# Altium schematic sheet P10_ATMEGA328P.SchDoc
size A4; SheetNumber: 1; SheetTotal: 2
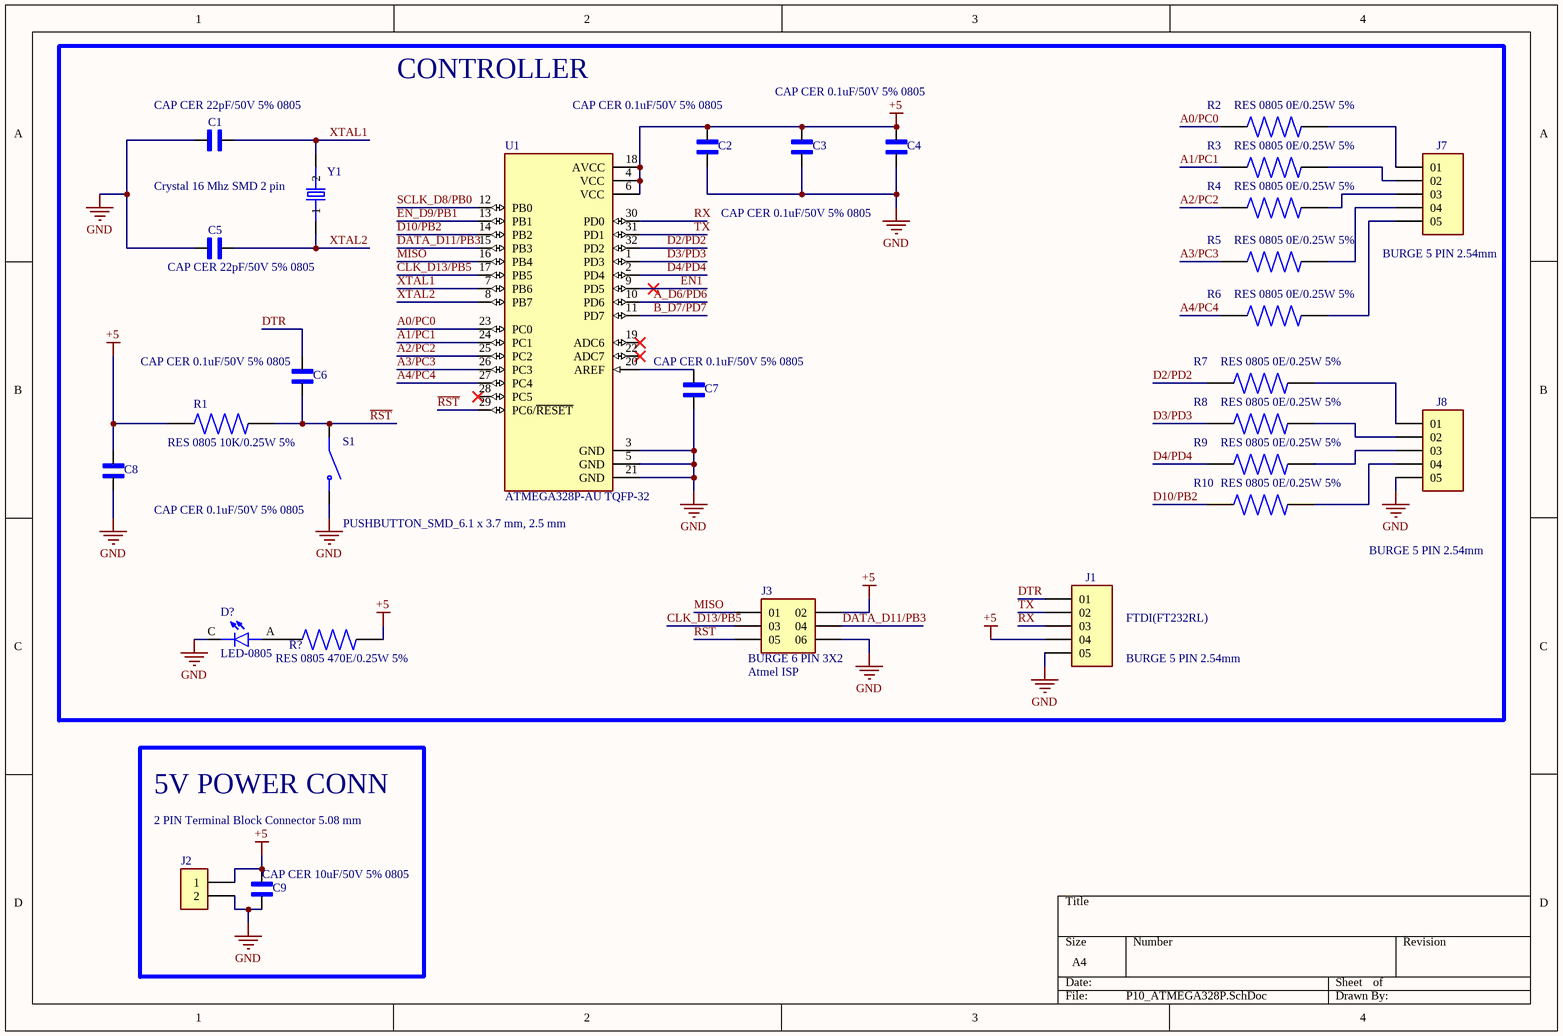
[diagram p0: P10_ATMEGA328P.SchDoc]

## Parts
C1  CAP CER 22pF/50V 5% 0805  [CAP CER 0.1uF/50V 5%]
C2  CAP CER 0.1uF/50V 5% 0805  [CAP CER 0.1uF/50V 5%]
C3  CAP CER 0.1uF/50V 5% 0805  [CAP CER 0.1uF/50V 5%]
C4  CAP CER 0.1uF/50V 5% 0805  [CAP CER 0.1uF/50V 5%]
C5  CAP CER 22pF/50V 5% 0805  [CAP CER 0.1uF/50V 5%]
C6  CAP CER 0.1uF/50V 5% 0805  [CAP CER 0.1uF/50V 5%]
C7  CAP CER 0.1uF/50V 5% 0805  [CAP CER 0.1uF/50V 5%]
C8  CAP CER 0.1uF/50V 5% 0805  [CAP CER 0.1uF/50V 5%]
C9  CAP CER 10uF/50V 5% 0805  [CAP CER 0.1uF/50V 5%]
D?  LED-0805  [LED-0805]
J1  BURGE 5 PIN 2.54mm  [BURGE 5 PIN]
J2  2 PIN Terminal Block Connector 5.08 mm  [2 PIN Terminal Block Connector 5.08 mm]
J3  BURGE 6 PIN 3X2  [BURGE 6 PIN 3X2]
J7  BURGE 5 PIN 2.54mm  [BURGE 5 PIN]
J8  BURGE 5 PIN 2.54mm  [BURGE 5 PIN]
R1  RES 0805 10K/0.25W 5%  [RES 0805 10K/0.25W 5%]
R2  RES 0805 0E/0.25W 5%  [RES 0805 10K/0.25W 5%]
R3  RES 0805 0E/0.25W 5%  [RES 0805 10K/0.25W 5%]
R4  RES 0805 0E/0.25W 5%  [RES 0805 10K/0.25W 5%]
R5  RES 0805 0E/0.25W 5%  [RES 0805 10K/0.25W 5%]
R6  RES 0805 0E/0.25W 5%  [RES 0805 10K/0.25W 5%]
R7  RES 0805 0E/0.25W 5%  [RES 0805 10K/0.25W 5%]
R8  RES 0805 0E/0.25W 5%  [RES 0805 10K/0.25W 5%]
R9  RES 0805 0E/0.25W 5%  [RES 0805 10K/0.25W 5%]
R10  RES 0805 0E/0.25W 5%  [RES 0805 10K/0.25W 5%]
R?  RES 0805 470E/0.25W 5%  [RES 0805 10K/0.25W 5%]
S1  PUSHBUTTON_SMD_6.1 x 3.7 mm, 2.5 mm  [PUSHBUTTON_SMD_6.1 x 3.7 mm, 2.5 mm]
U1  ATMEGA328P-AU TQFP-32  [ATMEGA328P-AU IC]
Y1  Crystal 16 Mhz SMD 2 pin  [Crystal 16 Mhz SMD 2 pin]

## Blocks framed on the sheet
CONTROLLER: C1-C8 D? J1 J3 J7 J8 R1-R10 R? S1 U1 Y1
5V POWER CONN: C9 J2

## Nets
+5: C2.2 C3.2 C4.2 C8.2 C9.2 J1.04 J2.1 J3.02 R1.1 R?.2 U1.4(VCC) U1.6(VCC) U1.18(AVCC)
GND: C1.1 C2.1 C3.1 C4.1 C5.1 C7.1 C8.1 C9.1 D?.C J1.05 J2.2 J3.06 J8.05 S1.2 U1.3(GND) U1.5(GND) U1.21(GND)
A0/PC0: R2.1 U1.23(PC0)
A1/PC1: R3.1 U1.24(PC1)
A2/PC2: R4.1 U1.25(PC2)
A3/PC3: R5.1 U1.26(PC3)
A4/PC4: R6.1 U1.27(PC4)
A_D6/PD6: U1.10(PD6)
B_D7/PD7: U1.11(PD7)
CLK_D13/PB5: J3.03 U1.17(PB5)
D2/PD2: R7.1 U1.32(PD2)
D3/PD3: R8.1 U1.1(PD3)
D4/PD4: R9.1 U1.2(PD4)
D10/PB2: R10.1 U1.14(PB2)
DATA_D11/PB3: J3.04 U1.15(PB3)
DTR: C6.2 J1.01
EN1: U1.9(PD5)
EN_D9/PB1: U1.13(PB1)
MISO: J3.01 U1.16(PB4)
~{RST}: C6.1 J3.05 R1.2 S1.1 U1.29(PC6/~{RESET})
RX: J1.03 U1.30(PD0)
SCLK_D8/PB0: U1.12(PB0)
TX: J1.02 U1.31(PD1)
XTAL1: C1.2 U1.7(PB6) Y1.2
XTAL2: C5.2 U1.8(PB7) Y1.1
NetC7_2: C7.2 U1.20(AREF)
NetD?_A: D?.A R?.1
NetJ7_01: J7.01 R2.2
NetJ7_02: J7.02 R3.2
NetJ7_03: J7.03 R4.2
NetJ7_04: J7.04 R5.2
NetJ7_05: J7.05 R6.2
NetJ8_01: J8.01 R7.2
NetJ8_02: J8.02 R8.2
NetJ8_03: J8.03 R9.2
NetJ8_04: J8.04 R10.2

Not connected (* = marked no-connect by the designer): U1 19(ADC6)* 22(ADC7)* 28(PC5)*

## Notes on the sheet
- FTDI(FT232RL)
- (near J3) Atmel ISP

## Library data of the parts
C1 = CAP CER 0.1uF/50V 5%: CAP CER 22pF/50V 5% Ceramic Capacitor X7R 0805 (2012 Metric); MF: Samsung; MP: CL21B104KCFNNNE; Purchase-URL: https://pricing.snapeda.com/search?q=CL21B104KCFNNNE&ref=eda; Package: 0805 Samsung; Check_prices: https://www.snapeda.com/parts/CL21B104KCFNNNE/Samsung+Electro-Mechanics/view-part/?ref=eda; Value: *; SnapEDA_Link: https://www.snapeda.com/parts/CL21B104KCFNNNE/Samsung+Electro-Mechanics/view-part/?ref=snap; Digi-Key_Part_Number: 1276-6840-2-ND
C2-C4 C6-C9 = CAP CER 0.1uF/50V 5%: CAP CER 0.1uF/50V  Ceramic Capacitor X7R 0805 (2012 Metric); MF: Samsung; MP: CL21B104KCFNNNE; Purchase-URL: https://pricing.snapeda.com/search?q=CL21B104KCFNNNE&ref=eda; Package: 0805 Samsung; Check_prices: https://www.snapeda.com/parts/CL21B104KCFNNNE/Samsung+Electro-Mechanics/view-part/?ref=eda; Value: *; SnapEDA_Link: https://www.snapeda.com/parts/CL21B104KCFNNNE/Samsung+Electro-Mechanics/view-part/?ref=snap; Digi-Key_Part_Number: 1276-6840-2-ND
C5 = CAP CER 0.1uF/50V 5%: CAP CER 22pF/50V 5%  Ceramic Capacitor X7R 0805 (2012 Metric); MF: Samsung; MP: CL21B104KCFNNNE; Purchase-URL: https://pricing.snapeda.com/search?q=CL21B104KCFNNNE&ref=eda; Package: 0805 Samsung; Check_prices: https://www.snapeda.com/parts/CL21B104KCFNNNE/Samsung+Electro-Mechanics/view-part/?ref=eda; Value: *; SnapEDA_Link: https://www.snapeda.com/parts/CL21B104KCFNNNE/Samsung+Electro-Mechanics/view-part/?ref=snap; Digi-Key_Part_Number: 1276-6840-2-ND
D? = LED-0805: Red 640nm LED Indication - Discrete 1.85V 0805 (2012 Metric) APT2012SRCPRV; MF: Kingbright; SnapEDA_Link: https://www.snapeda.com/parts/APT2012SRCPRV/Kingbright/view-part/?ref=snap; Package: 0805 Kingbright; Value: *; MP: APT2012SRCPRV; Check_prices: https://www.snapeda.com/parts/APT2012SRCPRV/Kingbright/view-part/?ref=eda
J1 J7 J8 = BURGE 5 PIN: MTSW-105-07-T-S-048 BURGE 5 PIN 2.54mm; MP: MTSW-105-07-T-S-048; Price: None; Package: None; Value: *; Availability: Unavailable
J2 = 2 PIN Terminal Block Connector 5.08 mm: MOLEX,Screw Type, Horizontal, 5.08 Pitch, 24~12 (AWG), Terminal Block Connector, TB007-508-02BE; MF: Same Sky; SnapEDA_Link: https://www.snapeda.com/parts/TB007-508-02BE/Same+Sky/view-part/?ref=snap; Package: None; Value: *; MP: TB007-508-02BE; Check_prices: https://www.snapeda.com/parts/TB007-508-02BE/Same+Sky/view-part/?ref=eda
J3 = BURGE 6 PIN 3X2: MTSW-103-X-X-D-X BURGE 6 PIN 3X2 2.54MM; MF: {'manufacturer': u'Samtec Inc.'}; Package: None; Price: None; Value: *; MP: MTSW-103-X-X-D-X; Availability: Unavailable
R1-R10 R? = RES 0805 10K/0.25W 5%: RESISTOR, THICK FILM, 10K, 5%, 0805, FRESISTOR, THICK FILM, 10K, 5%, 0805, FULL REEL Product Range:PANASONIC - ERJ Series; MP: ERJ-6GEYJ103V; MF: Panasonic Electronic; Price: None; Check_prices: https://www.snapeda.com/parts/ERJ-6GEYJ103V/Panasonic+Electronic+Components/view-part/?ref=eda; Package: 805-2 Panasonic; Purchase-URL: https://pricing.snapeda.com/search/part/ERJ-6GEYJ103V/?ref=eda; Availability: In Stock; SnapEDA_Link: https://www.snapeda.com/parts/ERJ-6GEYJ103V/Panasonic+Electronic+Components/view-part/?ref=snap; Value: *
S1 = PUSHBUTTON_SMD_6.1 x 3.7 mm, 2.5 mm: 6.1 x 3.7 mm, 2.5 mm Actuator Height, 260 gf, Red, Surface Mount, SPST, Tactile Switch, TS09-63-25-R-260-SMT-TR; MF: Same Sky; SnapEDA_Link: https://www.snapeda.com/parts/TS09-63-25-R-260-SMT-TR/Same+Sky/view-part/?ref=snap; Package: None; Value: *; MP: TS09-63-25-R-260-SMT-TR; Check_prices: https://www.snapeda.com/parts/TS09-63-25-R-260-SMT-TR/Same+Sky/view-part/?ref=eda
U1 = ATMEGA328P-AU: AVR ATMEGA328P-AU IC 8-Bit 20MHz 32KB (16K x 16) FLASH 32-TQFP (7x7); MF: Microchip; SnapEDA_Link: https://www.snapeda.com/parts/ATMEGA328P-AU/Microchip/view-part/?ref=snap; Package: TQFP-32 Microchip; Value: *; MP: ATMEGA328P-AU; Check_prices: https://www.snapeda.com/parts/ATMEGA328P-AU/Microchip/view-part/?ref=eda
Y1 = Crystal 16 Mhz SMD 2 pin: 16 MHz Â±30ppm Crystal 20pF 60 Ohms HC-49/US FOXSDLF/128-20; MF: Fox Electronics; SnapEDA_Link: https://www.snapeda.com/parts/FOXSDLF/128-20/Fox+Electronics/view-part/?ref=snap; Package: HC49SD Fox Electronics; Value: *; MP: FOXSDLF/128-20; Check_prices: https://www.snapeda.com/parts/FOXSDLF/128-20/Fox+Electronics/view-part/?ref=eda